# EAGLE design light (EAGLE 9.4.2)
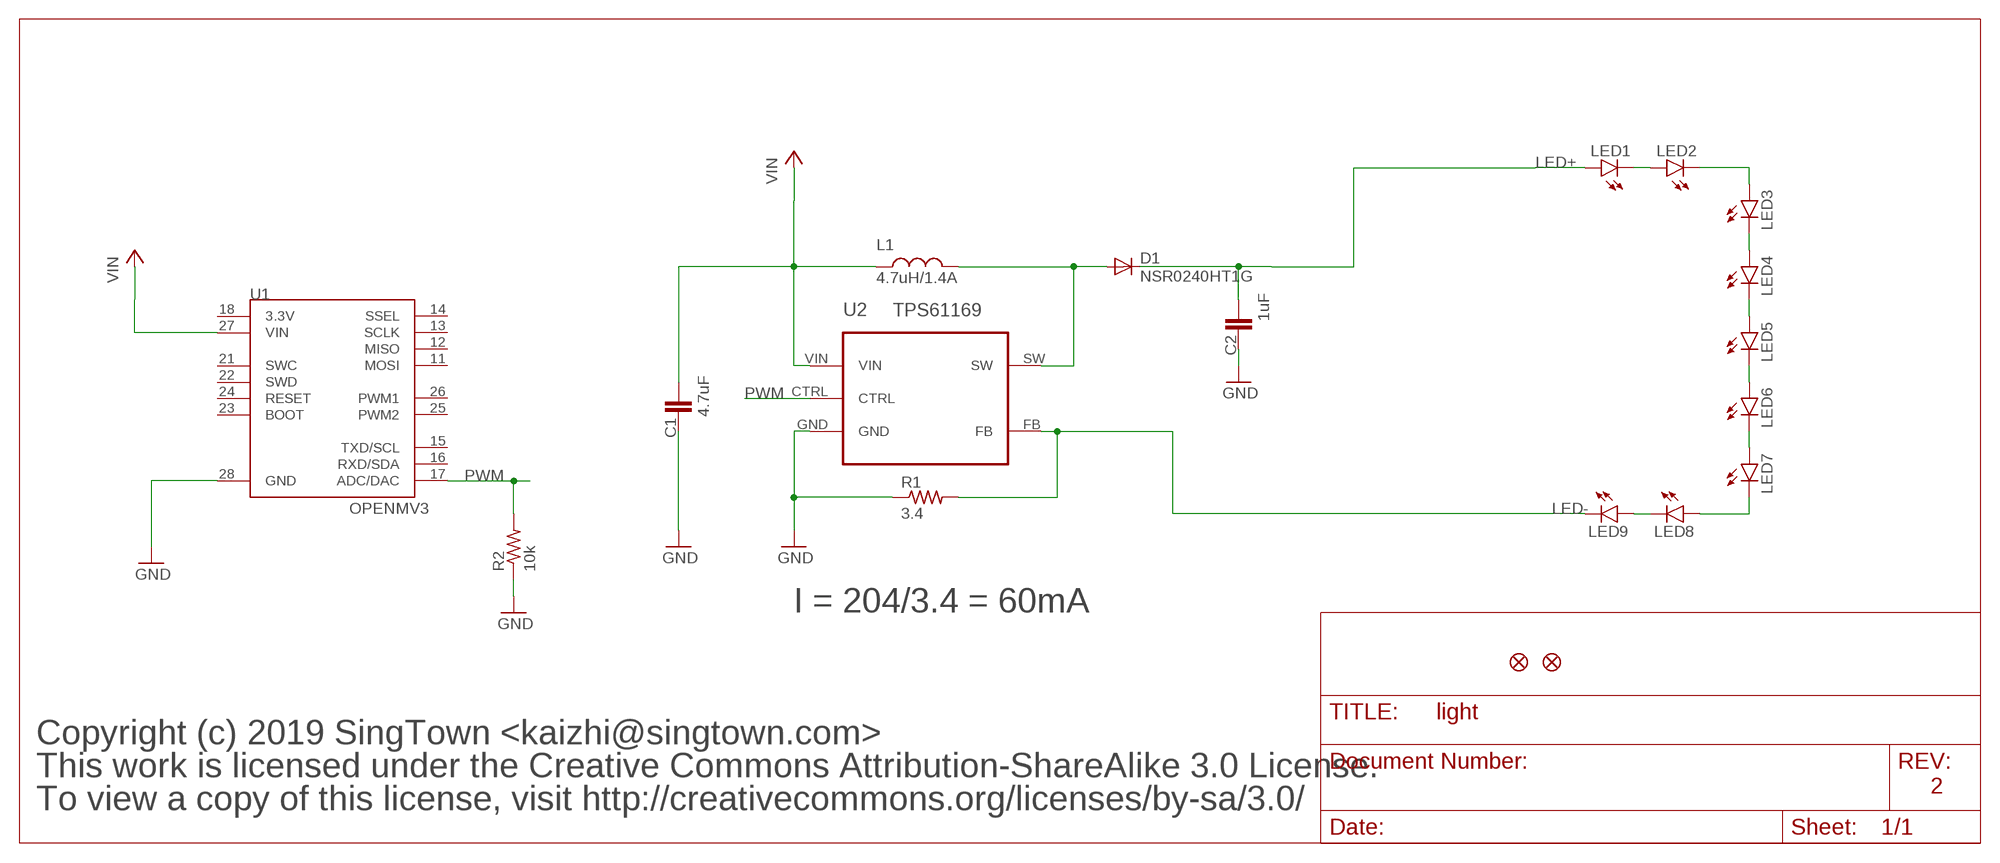
[diagram p0: schematic, sheet 1]

## Parts
C1  4.7uF  CAP0603-CAP  [0603-CAP]
C2  1uF  CAP0603-CAP  [0603-CAP]
D1  NSR0240HT1G  DIODESOD  [SOD-323]
L1  4.7uH/1.4A  INDUCTOR1007  [1007]
LED1  LEDKA-3528ASYC  [KA-3528ASYC]
LED2  LEDKA-3528ASYC  [KA-3528ASYC]
LED3  LEDKA-3528ASYC  [KA-3528ASYC]
LED4  LEDKA-3528ASYC  [KA-3528ASYC]
LED5  LEDKA-3528ASYC  [KA-3528ASYC]
LED6  LEDKA-3528ASYC  [KA-3528ASYC]
LED7  LEDKA-3528ASYC  [KA-3528ASYC]
LED8  LEDKA-3528ASYC  [KA-3528ASYC]
LED9  LEDKA-3528ASYC  [KA-3528ASYC]
R1  3.4  R-US_R0603  [R0603]
R2  10k  R-US_R0603  [R0603]
U1  OPENMV3  [OPENMV3]
U2  TPS61169  74AHCT1G04GW/T1  [SOT65P210X110-5N]
U$4  FIDUCIAL""  [FIDUCIAL_1MM]
U$8  FIDUCIAL""  [FIDUCIAL_1MM]

## Nets
GND: C1.2 C2.2 R1.1 R2.1 U1.28(GND) U2.GND
LED+: C2.1 D1.1(C) LED1.A
LED-: LED9.C R1.2 U2.FB
N$5: LED1.C LED2.A
N$13: LED2.C LED3.A
N$14: LED3.C LED4.A
N$15: LED4.C LED5.A
N$16: LED5.C LED6.A
N$19: LED6.C LED7.A
N$22: LED7.C LED8.A
N$23: LED8.C LED9.A
PWM: R2.2 U1.17(ADC/DAC) U2.CTRL
SW: D1.2(A) L1.2 U2.SW
VIN: C1.1 L1.1 U1.27(VIN) U2.VIN
Unconnected: U1.11(MOSI) U1.12(MISO) U1.13(SCLK) U1.14(SSEL) U1.15(TXD/SCL) U1.16(RXD/SDA) U1.18(3.3V) U1.21(SWC) U1.22(SWD) U1.23(BOOT) U1.24(RESET) U1.25(PWM2) U1.26(PWM1)

## Notes on the sheet
- I = 204/3.4 = 60mA
- Copyright (c) 2019 SingTown <kaizhi@singtown.com>
- This work is licensed under the Creative Commons Attribution-ShareAlike 3.0 License.
- 2
- To view a copy of this license, visit http://creativecommons.org/licenses/by-sa/3.0/

## Library data of the parts
C1 C2 = sfe:CAP: Capacitor Standard 0603 ceramic capacitor, and 0.1" leaded capacitor.
D1 = sfe:DIODE: Diode These are standard reverse protection diodes and small signal diodes. SMA package can handle up to about 1A. SOD-323 can handle about 200mA. What the SOD-323 package when ordering, there are some mfgs out there that are 5-pin packages.
L1 = sfe:INDUCTOR: Inductors Basic Inductor/Choke - 0603 and 1206. Footprints are not proven and vary greatly between part numbers.
LED1-LED9 = led:LED: LED OSRAM: - CHIPLED LG R971, LG N971, LY N971, LG Q971, LY Q971, LO R971, LY R971 LH N974, LH R974 LS Q976, LO Q976, LY Q976 LO Q996 - Hyper CHIPLED LW Q18S LB Q993, LB Q99A, LB R99A - SideLED LS A670, LO A670, LY A670, LG A670, LP A670 LB A673, LV A673, LT A673, LW A673 LH A674 LY A675 LS A676, LA A676, LO A676, LY A676, LW A676 LS A679, LY A679, LG A679 - Hyper Micro SIDELED® LS Y876, LA Y876, LO Y876, LY Y876 LT Y87S - SmartLED LW L88C, LW L88S LB L89C, LB L89S, LG L890 LS L89K, LO L89K, LY L89K LS L896, LA L896, LO L896, LY L896 - TOPLED LS T670, LO T670, LY T670, LG T670, LP T670 LSG T670, LSP T670, LSY T670, LOP T670, LYG T670 LG T671, LOG T671, LSG T671 LB T673, LV T673, LT T673, LW T673 LH T674 LS T676, LA T676, LO T676, LY T676, LB T676, LH T676, LSB T676, LW T676 LB T67C, LV T67C, LT T67C, LS T67K, LO T67K, LY T67K, LW E67C LS E67B, LA E67B, LO E67B, LY E67B, LB E67C, LV E67C, LT E67C LW T67C LS T679, LY T679, LG T679 LS T770, LO T770, LY T770, LG T770, LP T770 LB T773, LV T773, LT T773, LW T773 LH T774 LS E675, LA E675, LY E675, LS T675 LS T776, LA T776, LO T776, LY T776, LB T776 LHGB T686 LT T68C, LB T68C - Hyper Mini TOPLED® LB M676 - Mini TOPLED Santana® LG M470 LS M47K, LO M47K, LY M47K Source: http://www.osram.convergy.de LUXEON: - LUMILED® LXK2-PW12-R00, LXK2-PW12-S00, LXK2-PW14-U00, LXK2-PW14-V00 LXK2-PM12-R00, LXK2-PM12-S00, LXK2-PM14-U00 LXK2-PE12-Q00, LXK2-PE12-R00, LXK2-PE12-S00, LXK2-PE14-T00, LXK2-PE14-U00 LXK2-PB12-K00, LXK2-PB12-L00, LXK2-PB12-M00, LXK2-PB14-N00, LXK2-PB14-P00, LXK2-PB14-Q00 LXK2-PR12-L00, LXK2-PR12-M00, LXK2-PR14-Q00, LXK2-PR14-R00 LXK2-PD12-Q00, LXK2-PD12-R00, LXK2-PD12-S00 LXK2-PH12-R00, LXK2-PH12-S00 LXK2-PL12-P00, LXK2-PL12-Q00, LXK2-PL12-R00 Source: www.luxeon.com KINGBRIGHT: KA-3528ASYC Source: www.kingbright.com
R1 R2 = rcl:R-US_: RESISTOR, American symbol
U1 = openmv:OPENMV3
U2 = TPS61169:74AHCT1G04GW/T1: Inverter; MPN: 74AHCT1G04GW/T1; OC_FARNELL: 1085245; OC_NEWARK: 99K0509; PACKAGE: SOT353-1-5; SUPPLIER: NXP
U$4 U$8 = microbuilder:FIDUCIAL: Fiducial Alignment Points Various fiducial points for machine vision alignment.; BOM: EXCLUDE

## Net classes
1 vcc: width 1.016 mm, clearance 0.203 mm
2 antenna: width 0.363 mm, clearance 0.305 mm
3 1.8v: width 0.457 mm, clearance 0.254 mm

## Board
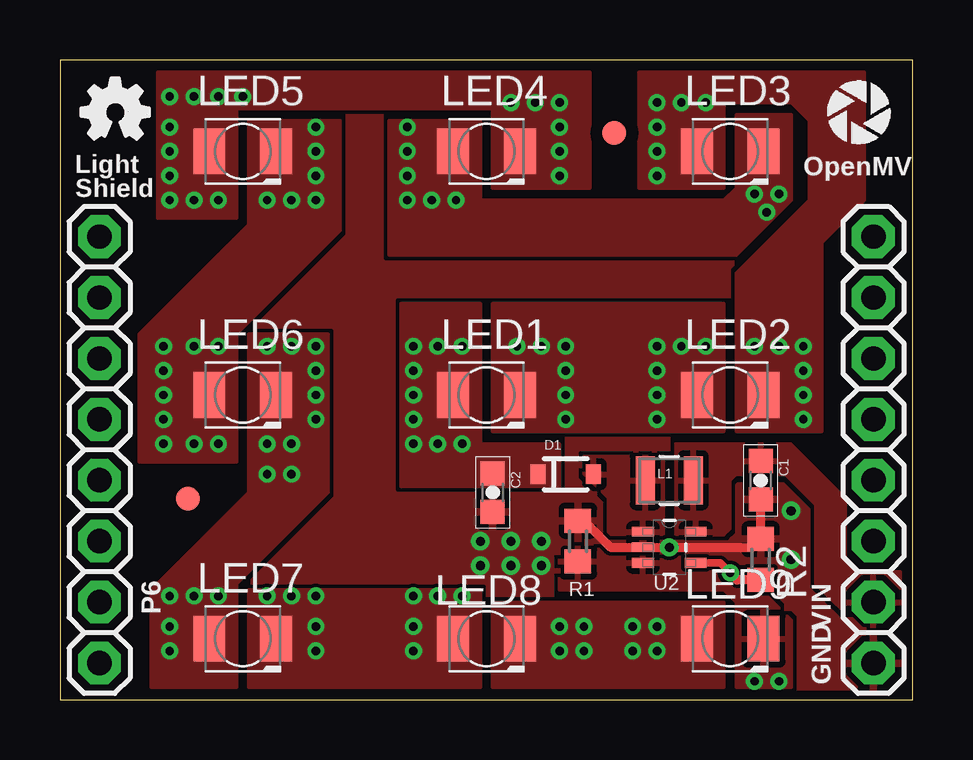
[diagram p1: board, top side]
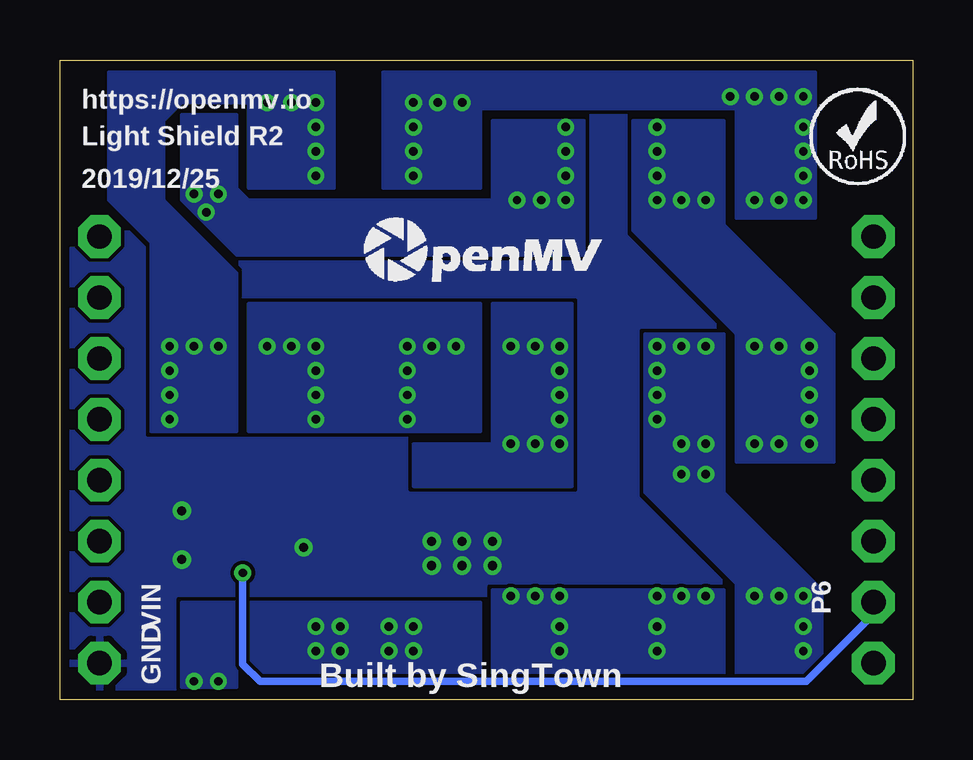
[diagram p2: board, bottom side, seen from below]

Size 35.56 x 26.67 mm. Coordinates in mm from the lower left corner, seen from the top.
Outline: 0,0 35.56,0 35.56,26.67 0,26.67 0,0
Copper layers (1*16): Top 0.0356mm / dielectric 1.5011mm / Bottom 0.0356mm
Design rules "default": minimum track width 6mil, minimum drill 13mil, track to track 6mil, track to pad 6mil, pad to pad 6mil, via to via 6mil, smd to smd 6mil, copper to edge 15mil, drill to drill 6mil, minimum pad ring 7mil, minimum via ring 7mil, stop-mask expansion 3mil, vias tented up to drill 30mil, thermal gap 10mil

### Footprints (pad centres in the part's own frame; a part is rotated, then mirrored left to right if it is on the bottom)
0603-CAP = smd 1 x 1: 1 -0.8,0; 2 0.8,0
SOD-323 = smd 0.63 x 0.83: 1 -1.15,0; 2 1.15,0
1007 = smd 2 x 0.8: 1 0,1; 2 0,-1
KA-3528ASYC = smd 1.33 x 1.9: A -1.39,0; C 1.39,0
R0603 = smd 1 x 1.1: 1 -0.85,0; 2 0.85,0
OPENMV3 = drill 1.016 pad 1.778 octagon: 11 1.651,19.304; 12 1.651,16.764; 13 1.651,14.224; 14 1.651,11.684; 15 1.651,9.144; 16 1.651,6.604; 17 1.651,4.064; 18 1.651,1.524; 21 33.909,19.304; 22 33.909,16.764; 23 33.909,14.224; 24 33.909,11.684; 25 33.909,9.144; 26 33.909,6.604; 27 33.909,4.064; 28 33.909,1.524
SOT65P210X110-5N = smd 0.9 x 0.4: CTRL 1.1,-0.65; FB -1.1,-0.65; GND -1.1,0; SW -1.1,0.65; VIN 1.1,0.65
FIDUCIAL_1MM = smd 1 x 1: 1 0,0

### Placement (x,y rotation side)
C1  29.21,9.14 270 top
C2  18.03,8.64 270 top
D1  21.08,9.4 0 top
L1  25.4,9.14 270 top
LED1  17.78,12.7 0 top
LED2  27.94,12.7 0 top
LED3  27.94,22.86 0 top
LED4  17.78,22.86 0 top
LED5  7.62,22.86 0 top
LED6  7.62,12.7 0 top
LED7  7.62,2.54 0 top
LED8  17.78,2.54 0 top
LED9  27.94,2.54 0 top
R1  21.59,6.6 270 top
R2  29.21,5.84 270 top
U1  0,0 0 top
U2  25.4,6.35 0 top
U$3  [ROHS]  4.32,21.46 0 bottom
U$4  5.33,8.38 0 top
U$8  23.11,23.62 0 top
U$9  OPENMV-LOGO  [OPENMV-LOGO]  31.88,22.99 0 top
U$10  [OMV-LOGO-SMALL]  22.99,17.27 0 bottom
U$11  [OSHW_FILLX100_NOTEXT]  0.89,23.37 0 top

### Tracks (layer width: path | path; a pad name or v marks a point on that pad's centre or on a via)
GND  (via drill 0.38)
  Top 0.381: R1.1 21.84,7.45 22.95,6.35 U2.GND v25.4,6.35 28.87,6.35 R2.1 C1.2
  other vias: 20.07,6.6 18.8,6.6 17.53,6.6 17.53,5.59 18.8,5.59 20.07,5.59 30.48,7.87 30.48,5.84
  pour Bottom (isolate 0.152, rank 2): 0,0 35.56,0 35.56,26.67 0,26.67
  pour Top (isolate 0.152, rank 2): 0,0 35.56,0 35.56,26.67 arc1 0,26.67
  pour Top: 28.45,8.89 30.23,8.89 30.99,8.13 30.99,4.83 33.27,2.54 35.05,2.54 35.05,0.51 30.99,0.51 30.99,3.56 28.45,6.1
  pour Top: 16.76,8.38 22.35,8.38 22.35,6.86 20.32,6.86 20.32,5.08 16.76,5.08
LED+  (via drill 0.35)
  other vias: 16.76,14.73 15.75,14.73 14.73,14.73 14.73,13.72 14.73,12.7 14.73,11.68 14.73,10.67 15.75,10.67 16.76,10.67
  pour Top (no thermals): 14.22,16.51 17.53,16.51 17.53,10.67 20.83,10.67 20.83,8.89 14.22,8.89
  pour Bottom: 14.22,16.51 17.53,16.51 17.53,10.67 20.83,10.67 20.83,8.89 14.22,8.89
LED-  (via drill 0.35)
  other vias: 28.96,0.76 29.97,0.76
  pour Top: 20.83,6.35 20.83,4.57 27.69,4.57 28.19,4.06 28.19,0.51 30.48,0.51 30.48,3.3 27.43,6.35
  pour Bottom: 28.19,0.51 30.48,0.51 30.48,4.06 28.19,4.06
N$5  (via drill 0.35)
  other vias: 19.05,14.73 20.07,14.73 21.08,14.73 21.08,13.72 21.08,12.7 21.08,11.68 26.92,14.73 25.91,14.73 24.89,14.73 24.89,13.72 24.89,12.7 24.89,11.68
  pour Top (no thermals): 18.03,16.51 27.69,16.51 27.69,11.18 18.03,11.18
  pour Bottom: 18.03,16.51 27.69,16.51 27.69,11.18 18.03,11.18
N$13  (via drill 0.35)
  other vias: 24.89,21.84 24.89,22.86 24.89,23.88 24.89,24.89 25.91,24.89 26.92,24.89 30.99,13.72 30.99,12.7 29.97,14.73 28.96,14.73 30.99,14.73 30.99,11.68
  pour Top (no thermals): 24.13,21.34 27.69,21.34 27.69,24.89 30.48,24.89 31.24,24.13 31.24,20.83 28.19,17.78 28.19,11.18 31.75,11.18 31.75,19.05 33.53,20.83 33.53,26.16 24.13,26.16
  pour Bottom: 24.13,26.16 33.53,26.16 33.53,20.83 31.75,19.05 31.75,11.18 28.19,11.18 28.19,17.78 31.24,20.83 31.24,24.13 30.48,24.89 27.69,24.89 27.69,21.34 24.13,21.34
N$14  (via drill 0.35)
  other vias: 14.48,23.88 14.48,22.86 14.48,21.84 14.48,20.83 15.49,20.83 16.51,20.83 28.96,21.08 29.97,21.08 29.46,20.32
  pour Top (no thermals): 13.72,24.13 17.53,24.13 17.53,20.83 27.69,20.83 28.19,21.34 28.19,24.38 30.48,24.38 30.48,20.83 28.19,18.54 13.72,18.54
  pour Bottom: 13.72,24.13 17.53,24.13 17.53,20.83 27.69,20.83 28.19,21.34 28.19,24.38 30.48,24.38 30.48,20.83 28.19,18.54 13.72,18.54
N$15  (via drill 0.35)
  other vias: 5.59,25.15 6.6,25.15 4.57,20.83 6.6,20.83 4.57,25.15 4.57,23.88 4.57,22.86 4.57,21.84 7.62,25.15 18.8,24.89 19.81,24.89 20.83,24.89 20.83,23.88 20.83,22.86 20.83,21.84 5.59,20.83
  pour Top (no thermals): 4.06,20.07 7.37,20.07 7.37,24.64 18.03,24.64 18.03,21.34 22.1,21.34 22.1,26.16 4.06,26.16
  pour Bottom: 4.06,26.16 22.1,26.16 22.1,21.34 18.03,21.34 18.03,24.64 7.37,24.64 7.37,20.07 4.06,20.07
N$16  (via drill 0.35)
  other vias: 10.67,23.88 10.67,22.86 10.67,21.84 8.64,20.83 9.65,20.83 10.67,20.83 6.6,10.67 5.59,10.67 4.32,10.67 4.32,11.68 4.32,12.7 4.32,13.72 4.32,14.73 6.6,14.73 5.59,14.73
  pour Top (no thermals): 7.87,24.13 11.68,24.13 11.68,19.56 7.37,15.24 7.37,9.91 3.3,9.91 3.3,15.24 7.87,19.81
  pour Bottom: 7.87,24.13 11.68,24.13 11.68,19.56 7.37,15.24 7.37,9.91 3.3,9.91 3.3,15.24 7.87,19.81
N$19  (via drill 0.35)
  other vias: 8.64,14.73 9.65,14.73 10.67,14.73 10.67,13.72 10.67,12.7 10.67,11.68 8.64,10.67 9.65,10.67 9.65,9.4 8.64,9.4 4.57,4.32 4.57,3.05 4.57,2.03 5.59,4.32 6.6,4.32
  pour Top (no thermals): 7.87,15.24 7.87,8.64 3.81,4.57 3.81,0.51 7.37,0.51 7.37,4.83 11.18,8.64 11.18,15.24
  pour Bottom: 7.87,15.24 11.18,15.24 11.18,8.64 7.37,4.83 7.37,0.51 3.81,0.51 3.81,4.57 7.87,8.64
N$22  (via drill 0.35)
  other vias: 8.64,4.32 9.65,4.32 10.67,4.32 10.67,3.05 10.67,2.03 14.73,2.03 14.73,3.05 16.76,4.32 15.75,4.32 14.73,4.32
  pour Top (no thermals): 7.87,4.57 17.53,4.57 17.53,0.51 7.87,0.51
  pour Bottom: 7.87,4.57 17.53,4.57 17.53,0.51 7.87,0.51
N$23  (via drill 0.35)
  other vias: 20.83,3.05 21.84,3.05 23.88,3.05 24.89,3.05 20.83,2.03 21.84,2.03 23.88,2.03 24.89,2.03
  pour Top (no thermals): 18.03,4.06 27.69,4.06 27.69,0.51 18.03,0.51
  pour Bottom: 18.03,4.06 27.69,4.06 27.69,0.51 18.03,0.51
PWM  (via drill 0.35)
  Top 0.305: U2.CTRL 27.53,5.7 v27.94,5.29
  Top 0.381: R2.2 28.23,4.99 v27.94,5.29
  Bottom 0.305: U1.17 1.65,3.56 4.45,0.76 27.23,0.76 27.94,1.48 v27.94,5.29
SW
  pour Top: 21.84,10.16 25.15,10.16 25.15,6.86 22.86,6.86 22.86,8.38 21.84,9.4
VIN
  pour Top: 25.65,6.86 27.69,6.86 27.94,7.11 27.94,9.14 28.19,9.4 30.23,9.4 31.5,8.13 31.5,4.83 33.27,3.05 35.05,3.05 35.05,5.33 33.27,5.33 32.77,5.84 32.77,8.38 30.48,10.67 25.65,10.67

### Text on the board
tPlace: OpenMV | Light / Shield | P6 | VIN | GND
bPlace: https://openmv.io | Light Shield R2 | 2019/12/25 | P6 | VIN | Built by SingTown | GND